# EAGLE schematic untitled (EAGLE 9.4.0)
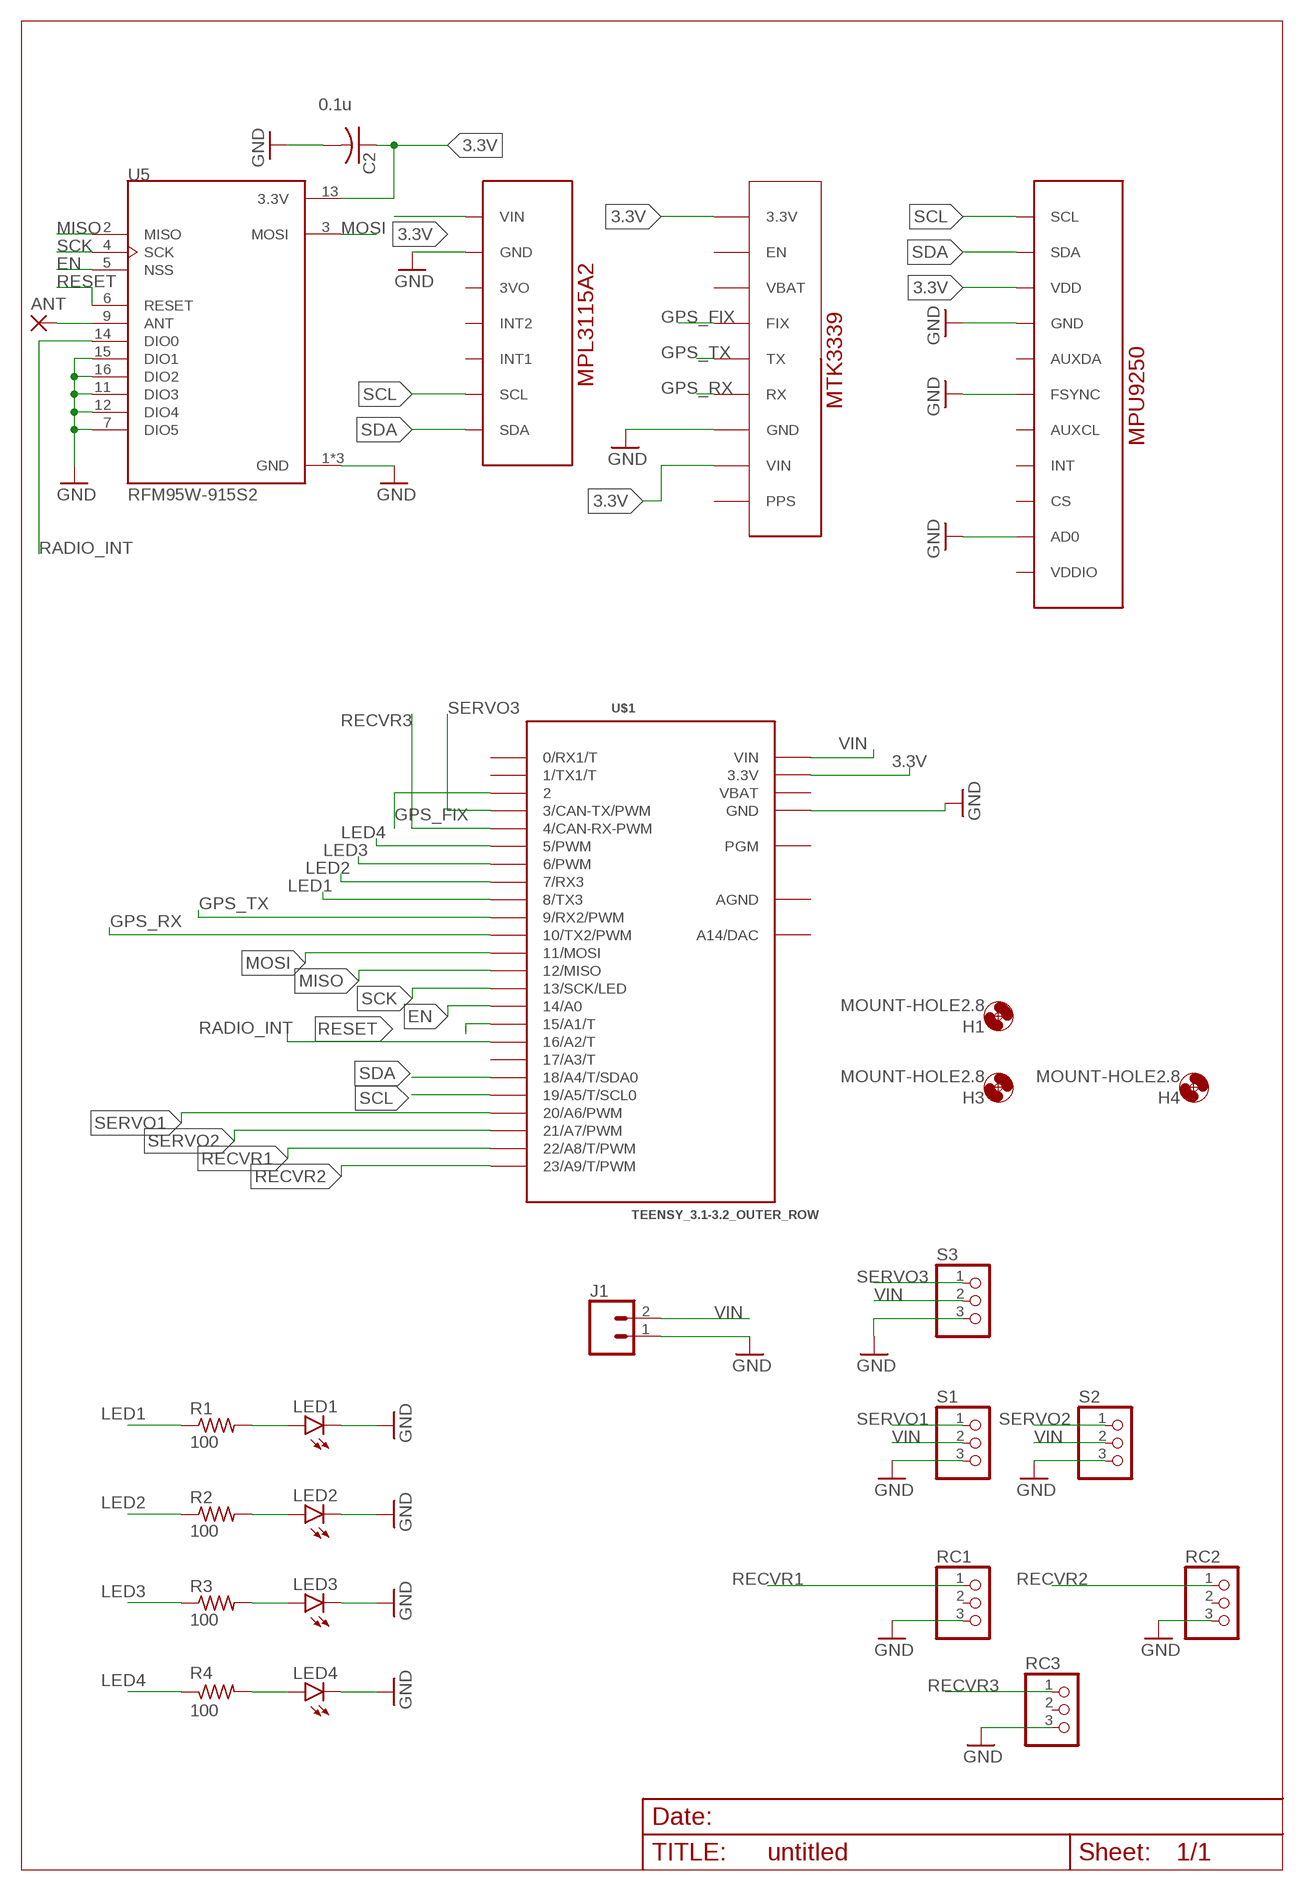
[diagram p0: schematic, sheet 1]

## Parts
ANT  2,54/0,9  [2,54/0,9]
C2  0.1u  C-USC1206  [C1206]
H1  MOUNT-HOLE2.8  [2,8]
H3  MOUNT-HOLE2.8  [2,8]
H4  MOUNT-HOLE2.8  [2,8]
J1  CONN_025MM  [SCREWTERMINAL-5MM-2]
LED1  LEDCHIPLED_1206  [CHIPLED_1206]
LED2  LEDCHIPLED_1206  [CHIPLED_1206]
LED3  LEDCHIPLED_1206  [CHIPLED_1206]
LED4  LEDCHIPLED_1206  [CHIPLED_1206]
R1  100  R-US_M1206  [M1206]
R2  100  R-US_M1206  [M1206]
R3  100  R-US_M1206  [M1206]
R4  100  R-US_M1206  [M1206]
RC1  PINHD-1X3  [1X03]
RC2  PINHD-1X3  [1X03]
RC3  PINHD-1X3  [1X03]
S1  PINHD-1X3  [1X03]
S2  PINHD-1X3  [1X03]
S3  PINHD-1X3  [1X03]
U1  ADAFRUIT_MPL3115A2_BAROMETER  [ADAFRUIT_MPL3115A2_BAROMETER]
U2  ADAFRUIT_MTK3339_GPS  [ADAFRUIT_MTK3339_GPS]
U4  SPARKFUN_MPU9250_IMU  [SPARKFUN_MPU9250_IMU]
U5  RFM95W-915S2  [XCVR_RFM95W-915S2]
U$1  TEENSY_3.1-3.2_OUTER_ROW  [TEENSY_3.0-3.2&LC_OUTER_ROW]

## Nets
3.3V: C2.1 U1.VIN U2.3.3V U2.VIN U4.VDD U5.13(3.3V) U$1.3.3V U$1.3.3V1(3.3V)
EN: U5.5(NSS) U$1.14/A0
GND: C2.2 J1.1 LED1.C LED2.C LED3.C LED4.C RC1.3 RC2.3 RC3.3 S1.3 S2.3 S3.3 U1.GND U2.GND U4.AD0 U4.FSYNC U4.GND U5.1(GND) U5.7(DIO5) U5.8(GND) U5.10(GND) U5.11(DIO3) U5.12(DIO4) U5.15(DIO1) U5.16(DIO2) U$1.GND U$1.GND1(GND)
GPS_FIX: U2.FIX U$1.2
GPS_RX: U2.RX U$1.10(10/TX2/PWM)
GPS_TX: U2.TX U$1.9(9/RX2/PWM)
LED1: R1.1 U$1.8(8/TX3)
LED2: R2.1 U$1.7(7/RX3)
LED3: R3.1 U$1.6(6/PWM)
LED4: R4.1 U$1.5(5/PWM)
MISO: U5.2(MISO) U$1.12(12/MISO)
MOSI: U5.3(MOSI) U$1.11(11/MOSI)
N$1: ANT.1(P) U5.9(ANT)
N$8: LED1.A R1.2
N$9: LED2.A R2.2
N$10: LED3.A R3.2
N$11: LED4.A R4.2
RADIO_INT: U5.14(DIO0) U$1.16/A2(16/A2/T)
RECVR1: RC1.1 U$1.22/A8(22/A8/T/PWM)
RECVR2: RC2.1 U$1.23/A9(23/A9/T/PWM)
RECVR3: RC3.1 U$1.4(4/CAN-RX-PWM)
RESET: U5.6(RESET) U$1.15/A1(15/A1/T)
SCK: U5.4(SCK) U$1.13(13/SCK/LED)
SCL: U1.SCL U4.SCL U$1.19/A5(19/A5/T/SCL0)
SDA: U1.SDA U4.SDA U$1.18/A4(18/A4/T/SDA0)
SERVO1: S1.1 U$1.20/A6(20/A6/PWM)
SERVO2: S2.1 U$1.21/A7(21/A7/PWM)
SERVO3: S3.1 U$1.3(3/CAN-TX/PWM)
VIN: J1.2 S1.2 S2.2 S3.2 U$1.VIN
Unconnected: RC1.2 RC2.2 RC3.2 U1.3VO U1.INT1 U1.INT2 U2.EN U2.PPS U2.VBAT U4.AUXCL U4.AUXDA U4.CS U4.INT U4.VDDIO U$1.0(0/RX1/T) U$1.1(1/TX1/T) U$1.17/A3(17/A3/T) U$1.PGM U$1.RESET/DAC(A14/DAC)

## Power pins joined to a net without a drawn wire
AGND: U$1.AGND
VBAT: U$1.VBAT

## Library data of the parts
ANT = wirepad:2,54/0,9: THROUGH-HOLE PAD
C2 = rcl:C-US: CAPACITOR, American symbol; SPICEPREFIX: C
H1 H3 H4 = holes:MOUNT-HOLE: MOUNTING HOLE with drill center marker
J1 = SparkFun-Connectors:CONN_02: Multi connection point. Often used as Generic Header-pin footprint for 0.1 inch spaced/style header connections On any of the 0.1 inch spaced packages, you can populate with these: Break Away Headers - Straight <https://www.sparkfun.com/products/116> (PRT-00116) Break Away Male Headers - Right Angle <https://www.sparkfun.com/products/553> (PRT-00553) Female Headers <https://www.sparkfun.com/products/115> (PRT-00115) Break Away Headers - Machine Pin <https://www.sparkfun.com/products/117> (PRT-00117) Break Away Female Headers - Swiss Machine Pin <https://www.sparkfun.com/products/743> (PRT-00743) For SCREWTERMINALS and SPRING TERMINALS visit here: Screw Terimnals on SparkFun.com <https://www.sparkfun.com/search/results?term=Screw+Terminals> (5mm/3.5mm/2.54mm spacing) This device is also useful as a general connection point to wire up your design to another part of your project. Our various solder wires solder well into these plated through hole pads. Hook-Up Wire - Assortment (Stranded, 22 AWG) <https://www.sparkfun.com/products/11375> (PRT-11375) Hook-Up Wire - Assortment (Solid Core, 22 AWG) <https://www.sparkfun.com/products/11367> (PRT-11367) View the entire wire category on our website here <https://www.sparkfun.com/categories/141> Special notes: Molex polarized connector foot print use with: PRT-08233 with associated crimp pins and housings. 2.54_SCREWTERM for use with PRT-10571. 3.5mm Screw Terminal footprints for PRT-08084 5mm Screw Terminal footprints for use with PRT-08432; SF_SKU: PRT-08432
LED1-LED4 = led:LED: LED OSRAM: - CHIPLED LG R971, LG N971, LY N971, LG Q971, LY Q971, LO R971, LY R971 LH N974, LH R974 LS Q976, LO Q976, LY Q976 LO Q996 - Hyper CHIPLED LW Q18S LB Q993, LB Q99A, LB R99A - SideLED LS A670, LO A670, LY A670, LG A670, LP A670 LB A673, LV A673, LT A673, LW A673 LH A674 LY A675 LS A676, LA A676, LO A676, LY A676, LW A676 LS A679, LY A679, LG A679 - Hyper Micro SIDELED® LS Y876, LA Y876, LO Y876, LY Y876 LT Y87S - SmartLED LW L88C, LW L88S LB L89C, LB L89S, LG L890 LS L89K, LO L89K, LY L89K LS L896, LA L896, LO L896, LY L896 - TOPLED LS T670, LO T670, LY T670, LG T670, LP T670 LSG T670, LSP T670, LSY T670, LOP T670, LYG T670 LG T671, LOG T671, LSG T671 LB T673, LV T673, LT T673, LW T673 LH T674 LS T676, LA T676, LO T676, LY T676, LB T676, LH T676, LSB T676, LW T676 LB T67C, LV T67C, LT T67C, LS T67K, LO T67K, LY T67K, LW E67C LS E67B, LA E67B, LO E67B, LY E67B, LB E67C, LV E67C, LT E67C LW T67C LS T679, LY T679, LG T679 LS T770, LO T770, LY T770, LG T770, LP T770 LB T773, LV T773, LT T773, LW T773 LH T774 LS E675, LA E675, LY E675, LS T675 LS T776, LA T776, LO T776, LY T776, LB T776 LHGB T686 LT T68C, LB T68C - Hyper Mini TOPLED® LB M676 - Mini TOPLED Santana® LG M470 LS M47K, LO M47K, LY M47K Source: http://www.osram.convergy.de LUXEON: - LUMILED® LXK2-PW12-R00, LXK2-PW12-S00, LXK2-PW14-U00, LXK2-PW14-V00 LXK2-PM12-R00, LXK2-PM12-S00, LXK2-PM14-U00 LXK2-PE12-Q00, LXK2-PE12-R00, LXK2-PE12-S00, LXK2-PE14-T00, LXK2-PE14-U00 LXK2-PB12-K00, LXK2-PB12-L00, LXK2-PB12-M00, LXK2-PB14-N00, LXK2-PB14-P00, LXK2-PB14-Q00 LXK2-PR12-L00, LXK2-PR12-M00, LXK2-PR14-Q00, LXK2-PR14-R00 LXK2-PD12-Q00, LXK2-PD12-R00, LXK2-PD12-S00 LXK2-PH12-R00, LXK2-PH12-S00 LXK2-PL12-P00, LXK2-PL12-Q00, LXK2-PL12-R00 Source: www.luxeon.com KINGBRIGHT: KA-3528ASYC Source: www.kingbright.com
R1-R4 = rcl:R-US_: RESISTOR, American symbol; SPICEPREFIX: R
RC1-RC3 S1-S3 = pinhead:PINHD-1X3: PIN HEADER
U1 = AERO_Eagle_Library:ADAFRUIT_MPL3115A2_BAROMETER: Adafruit's Barometer and Environment Sensing: MPL3115A2 https://www.adafruit.com/product/1893
U2 = AERO_Eagle_Library:ADAFRUIT_MTK3339_GPS: Adafruit's Ultimate GPS Breakout: MTK3339 https://www.adafruit.com/product/746
U4 = AERO_Eagle_Library:SPARKFUN_MPU9250_IMU: Sparkfun's 9-DOF IMU: MPU9250 https://www.sparkfun.com/products/13762
U5 = RFM95W-915S2:RFM95W-915S2: RFM95(W) - Low Power Long Range Transceiver Module V1.0; DESCRIPTION: RFM95W LoRA Transceiver Module 915MHz; DIGI-KEY_PART_NUMBER: RFM95W-915S2-ND; DIGI-KEY_PURCHASE_URL: https://www.digikey.ca/product-detail/en/rf-solutions/RFM95W-915S2/RFM95W-915S2-ND/6564923?utm_source=snapeda&utm_medium=aggregator&utm_campaign=symbol; MF: RF Solutions; MP: RFM95W-915S2; PACKAGE: SMD-16 RF Solutions
U$1 = Teensy_3_and_LC_Series_Boards_v1.4:TEENSY_3.1-3.2_OUTER_ROW: Footprint for Teensy 3.1 or 3.2 board using all pin connections on the outer perimeter